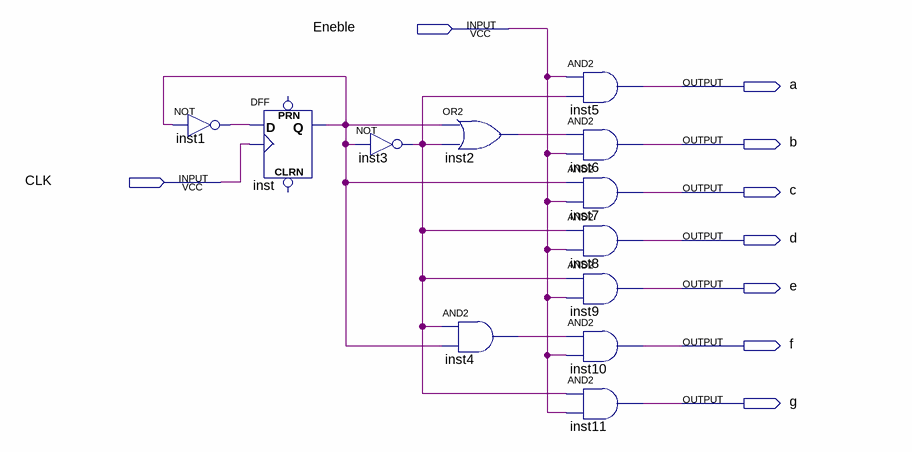
[diagram p0: schematic sheet]
// Quartus schematic Yellow_FND.bdf as structural Verilog: 12 symbols, 9 pins
module Yellow_FND (
  input  Eneble,
  input  CLK,
  output a,
  output b,
  output c,
  output d,
  output e,
  output f,
  output g
);

  wire inst1_out, inst2_out, inst3_out, inst4_out, inst_q;

  not inst1 (inst1_out, inst_q);
  DFF inst (.CLK(CLK), .D(inst1_out), .Q(inst_q));  // open: CLRN, PRN
  not inst3 (inst3_out, inst_q);
  or inst2 (inst2_out, inst_q, inst3_out);
  and inst4 (inst4_out, inst3_out, inst_q);
  and inst5 (a, Eneble, inst3_out);
  and inst6 (b, inst2_out, Eneble);
  and inst7 (c, inst_q, Eneble);
  and inst8 (d, inst3_out, Eneble);
  and inst9 (e, inst3_out, Eneble);
  and inst10 (f, inst4_out, Eneble);
  and inst11 (g, inst3_out, Eneble);
endmodule
